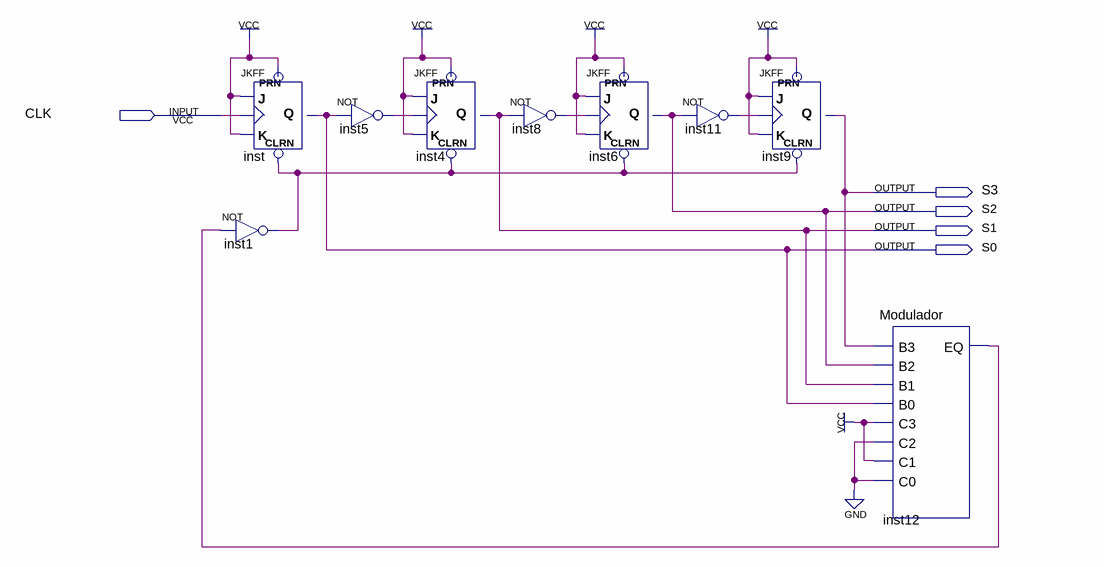
[diagram p0: schematic sheet]
// Quartus schematic Contador_Progressivo.bdf as structural Verilog: 9 symbols, 5 pins
module Contador_Progressivo (
  input  CLK,
  output S3,
  output S2,
  output S1,
  output S0
);

  wire inst1_out, inst5_out, inst8_out, inst11_out, inst12_eq;

  JKFF inst (.PRN(1'b1), .CLRN(inst1_out), .K(1'b1), .J(1'b1), .CLK(CLK), .Q(S0));
  not inst1 (inst1_out, inst12_eq);
  not inst5 (inst5_out, S0);
  JKFF inst4 (.PRN(1'b1), .CLRN(inst1_out), .K(1'b1), .J(1'b1), .CLK(inst5_out), .Q(S1));
  not inst8 (inst8_out, S1);
  JKFF inst6 (.PRN(1'b1), .CLRN(inst1_out), .K(1'b1), .J(1'b1), .CLK(inst8_out), .Q(S2));
  not inst11 (inst11_out, S2);
  JKFF inst9 (.PRN(1'b1), .CLRN(inst1_out), .K(1'b1), .J(1'b1), .CLK(inst11_out), .Q(S3));
  Modulador inst12 (.B3(S3), .B2(S2), .B1(S1), .B0(S0), .C3(1'b1), .C2(1'b0), .C1(1'b1), .C0(1'b0), .EQ(inst12_eq));
endmodule
